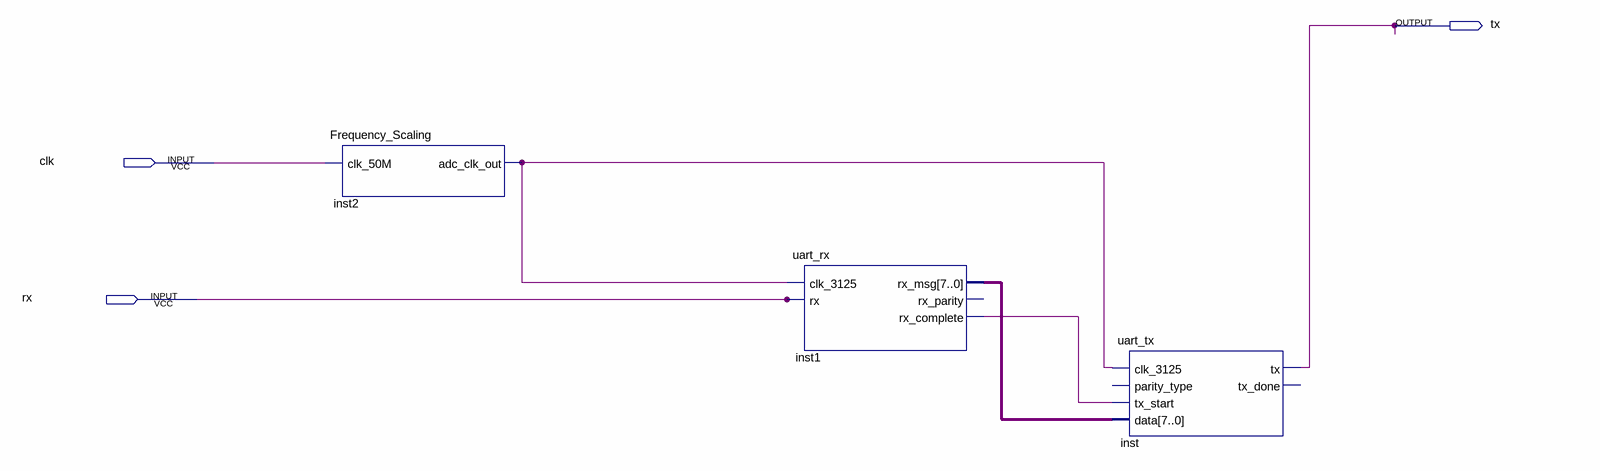
[diagram p0: schematic sheet]
// Quartus schematic UART_BLM.bdf as structural Verilog: 3 symbols, 3 pins
module UART_BLM (
  input  clk,
  input  rx,
  output tx
);

  wire inst1_rx_complete, inst2_adc_clk_out;
  wire [7:0] inst1_rx_msg;

  Frequency_Scaling inst2 (.clk_50M(clk), .adc_clk_out(inst2_adc_clk_out));
  uart_rx inst1 (
    .clk_3125(inst2_adc_clk_out), .rx(rx), .rx_msg(inst1_rx_msg), .rx_complete(inst1_rx_complete));  // open: rx_parity
  uart_tx inst (
    .clk_3125(inst2_adc_clk_out), .tx_start(inst1_rx_complete), .data(inst1_rx_msg), .tx(tx));  // open: parity_type, tx_done
endmodule
